# EasyEDA Pro project jlcProject.epro, schematic Schematic2
Create Date: 2025-03-26; Page Name: P1; Project Name: 电综; Schematic Name: Schematic2; Update Date: 2025-03-26; Company: 嘉立创EDA; Page Size: A4; Version: V1.0
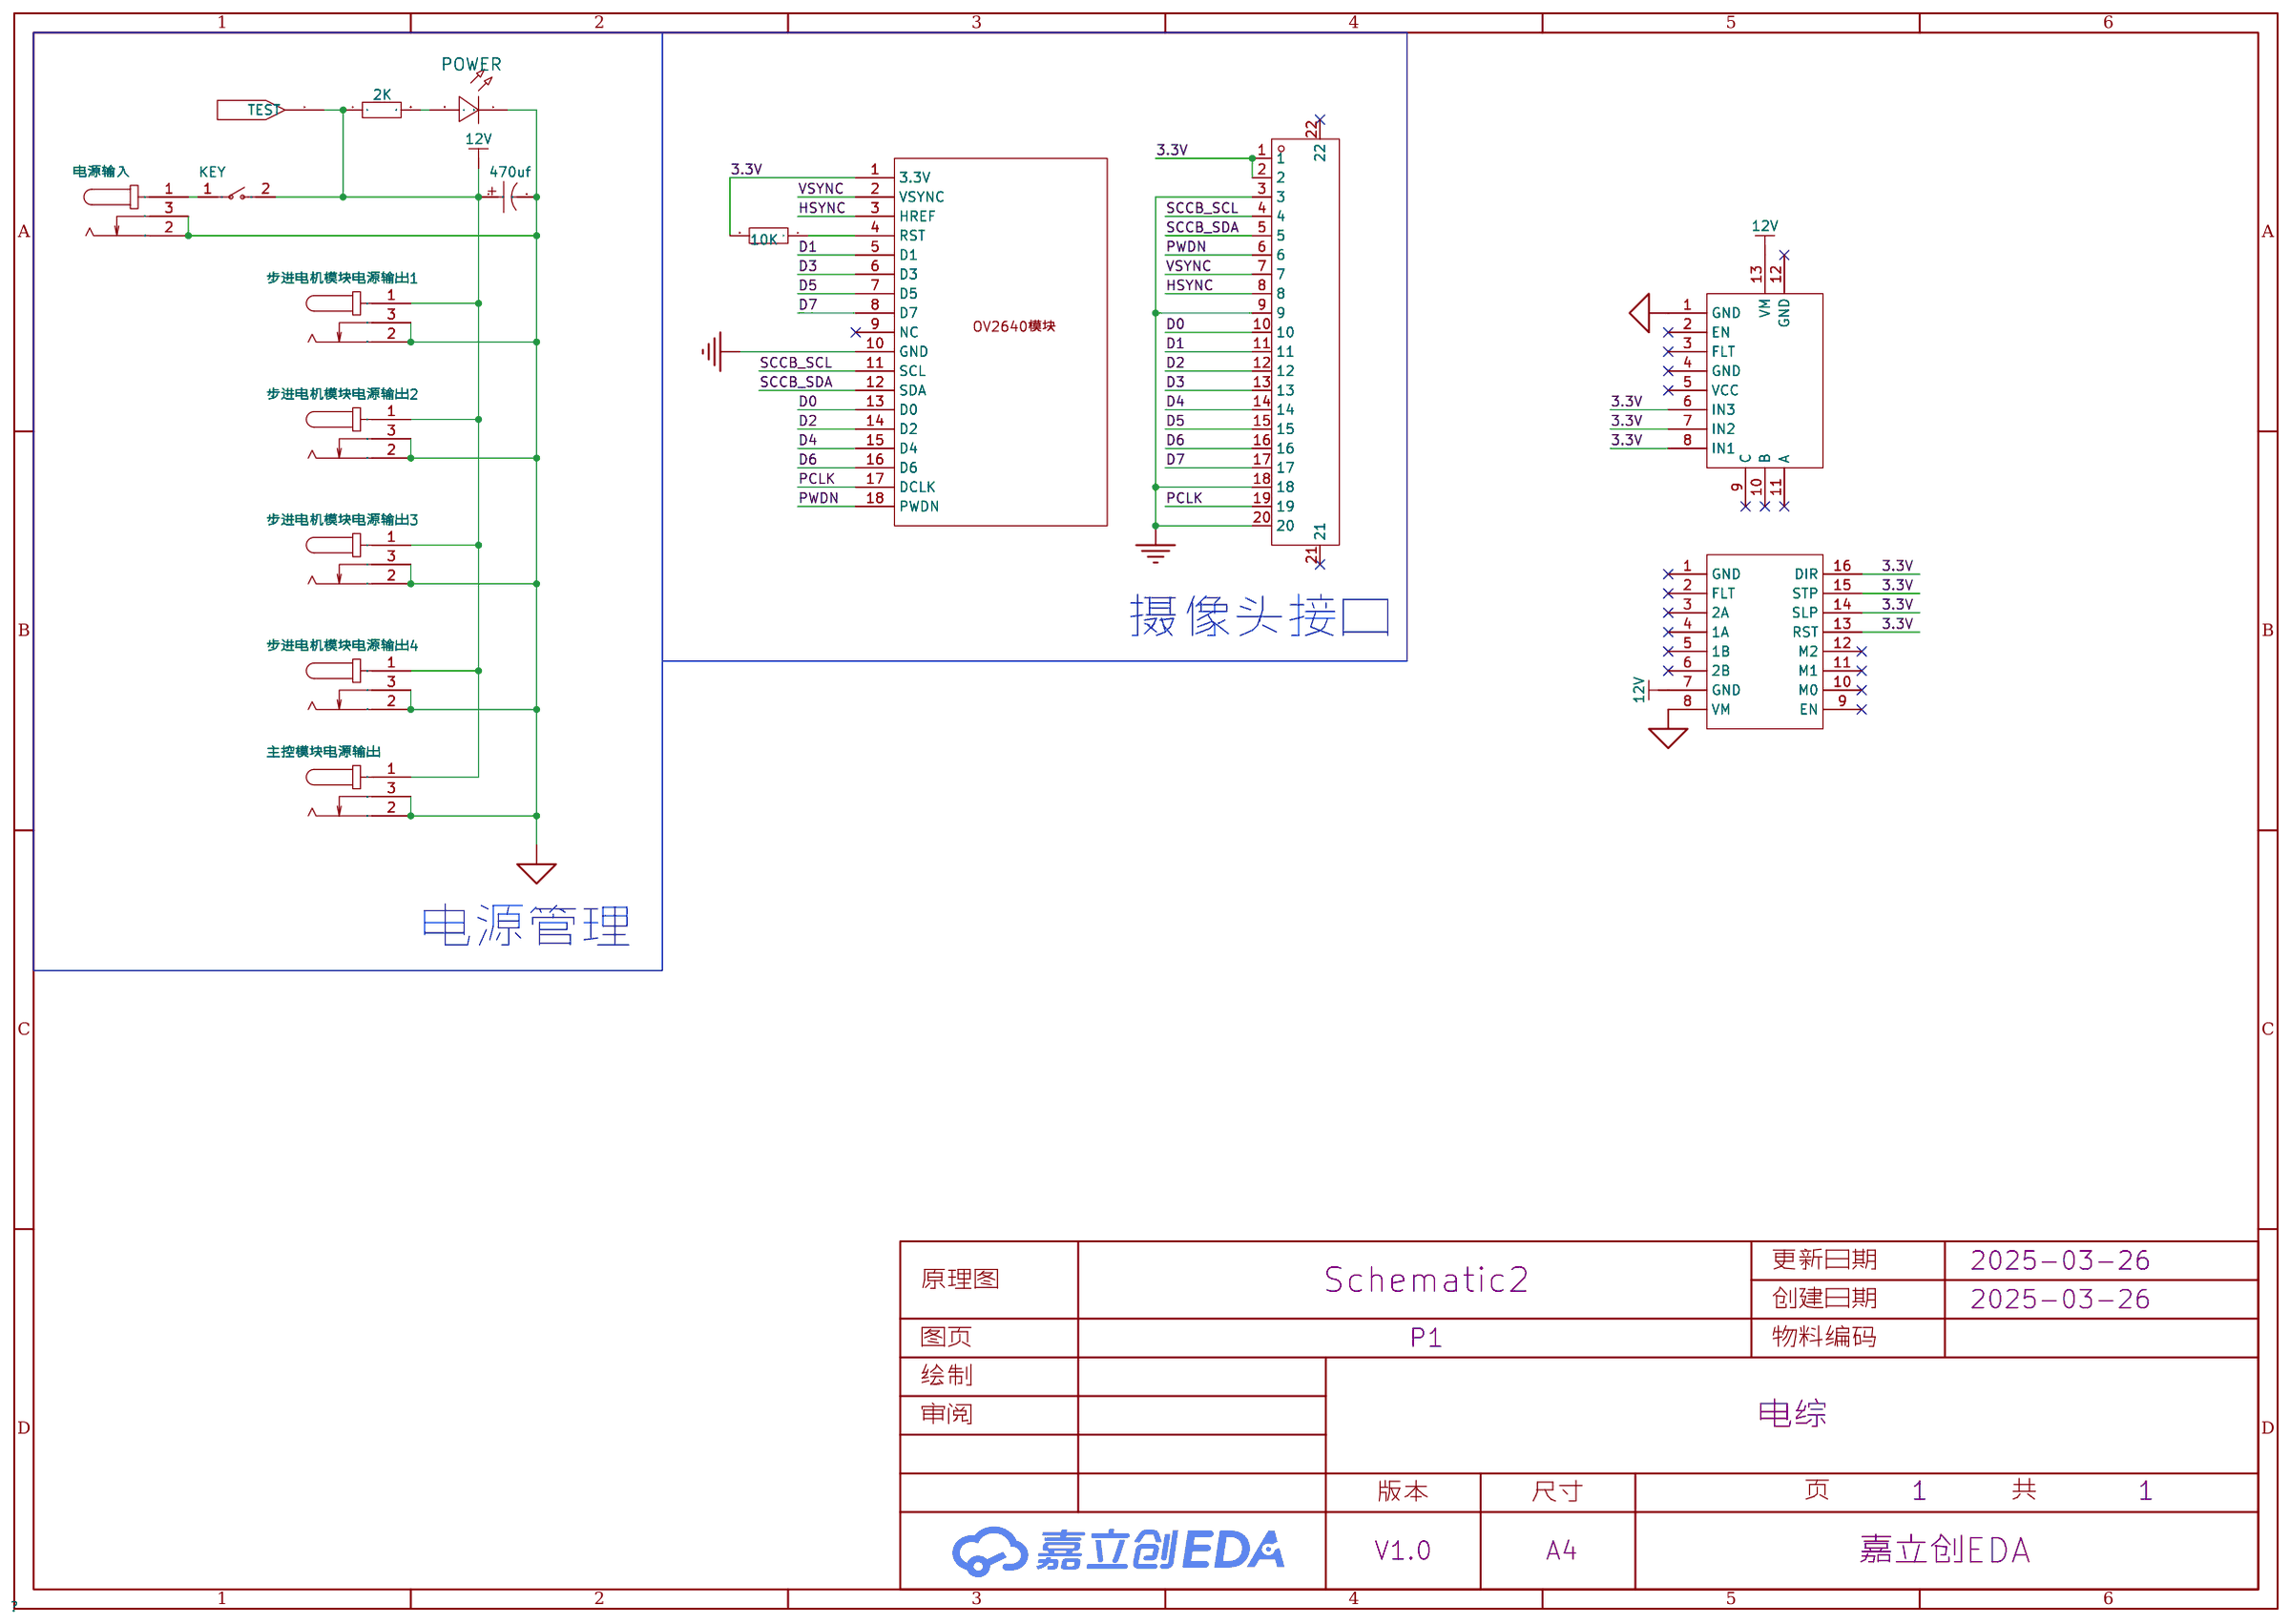
[diagram p1: schematic sheet]

## Parts
C1  470uf  [CAP-SMD_BD10.0-L10.3-W10.3-FD]
DC1  电源输入  [DC-IN-TH_DC005]
DC2  步进电机模块电源输出1  [DC-IN-TH_DC005]
DC7  步进电机模块电源输出2  [DC-IN-TH_DC005]
DC8  步进电机模块电源输出3  [DC-IN-TH_DC005]
DC9  步进电机模块电源输出4  [DC-IN-TH_DC005]
DC10  主控模块电源输出  [DC-IN-TH_DC005]
FPC1  FPC-05F-20PH20  [FPC-SMD_20P-P0.50_XUNPU_FPC-05F-20PH20]
POWER  -  [LED_0805]
R1  2K  [R0805]
R2  10K  [R0805]
SW1  KEY  [SW-TH_2P-L15.0-W10.5-P5.00_KCD11-2P-R]
U1  -  [测试点]
U2  -  [OV2640模块]
U3  -  [FOCMini]
U4  -  [DRV8825驱动模块]

## Library data of the parts
C1 = CK1V471M-CRG10: 容值:470uF;精度:±20%;额定电压:35V;纹波电流:-;等效串联电阻(ESR):-;; LCSC Part Name: 470uF ±20% 35V; Supplier Part: C129479; Manufacturer: ST(先科); Supplier Footprint: SMD,D10xL10.5mm; JLCPCB Part Class: Extended Part; Datasheet: https://atta.szlcsc.com/upload/public/pdf/source/20180511/C191812_AFB6060B7C8A92684C0DBB73273612B6.pdf; Supplier: LCSC; Tolerance: ±20%; Voltage Rating: 35V; Diameter: 10mm; Height - Seated (Max): 10.5mm; Lifetime: 2000hrs@105℃; Operating Temperature: -40℃~+105℃
DC1 DC2 DC7-DC10 = DC005: 连接器类型:DC电源插座;安装方式:弯插;触点内径:2mm;触点外径:6.3mm;额定电流:500mA;额定电压:30V;工作温度范围:-25℃~+70℃;; LCSC Part Name: DC电源插座 内径:2mm 外径:6.3mm; Supplier Part: C431533; Manufacturer: SHOU HAN(首韩); Supplier Footprint: 插件; JLCPCB Part Class: Extended Part; Datasheet: https://atta.szlcsc.com/upload/public/pdf/source/20190925/C431533_4751811035784AC1D38EBC85F7905E99.pdf; Supplier: LCSC; Connector Type: DC电源插座; Mounting Style: 弯插; Inside Contact Diameter: 2mm; Outside Contact Diameter: 6.3mm; Current Rating (Max): 500mA; Voltage Rating (Max): 30V; Operating Temperature Range: -25℃~+70℃
FPC1 = FPC-05F-20PH20: 锁定特性:翻盖式;触点类型:下接;触点数量:20P;间距:0.5mm;安装类型:卧贴;工作温度范围:-25℃~+85℃;; LCSC Part Name: 间距:0.5mm P数:20P 翻盖式 下接; Supplier Part: C2856803; Manufacturer: XUNPU(讯普); Supplier Footprint: SMD,P=0.5mm,卧贴; JLCPCB Part Class: Extended Part; Datasheet: https://atta.szlcsc.com/upload/public/pdf/source/20210922/C2856803_40AC94077DCDAD136B773224EC50E565.pdf; Supplier: LCSC; Locking Feature: 翻盖式; Contact Type: 下接; Number of Contacts: 20P; Pitch: 0.5mm; Mounting Type: 卧贴; FFC, FCB Thickness: 0.3mm; Height Above Board: 2mm; Operating Temperature Range: -25℃~+85℃
POWER = LED_0805-R: Supplier Footprint: 0805
R1 R2 = Res_0805: Supplier Footprint: 0805
SW1 = KCD11-2P-R: 带灯:无;引脚样式:焊片;额定电流:3A;额定电压(AC):250V;额定电压(DC):-;电路结构:单刀单掷;机械寿命:1万次;; LCSC Part Name: 10.5*15mm 两脚两档跷板开关 红钮; Supplier Part: C5884414; Manufacturer: SHOU HAN(首韩); Supplier Footprint: 插件; JLCPCB Part Class: Extended Part; Datasheet: https://atta.szlcsc.com/upload/public/pdf/source/20230506/CD06DFDE35C8048D34175BFF4AF6A2C2.pdf; Supplier: LCSC; Switch Length: 15mm; Switch Width: 10.5mm; Switch Height: 17.2mm; Actuator Type: 凹面弯曲; With Lamp: 无; Pin Style: 焊片; Actuator Color: 红色; Contact Current: 3A; Voltage Rating (AC): 250V; Circuit: 单刀单掷; Mechanical Life: 1万次; Operating Temperature: 0℃~+125℃; Actuator Identifier: - O
U1 = 测试点
U2 = OV2640模块
U3 = FOCMini
U4 = DRV8825模块

## Nets
3.3V: FPC1.1 FPC1.2 R2.2 U2.1(3.3V) U3.6(IN3) U3.7(IN2) U3.8(IN1) U4.13(RST) U4.14(SLP) U4.15(STP) U4.16(DIR)
12V: C1.1 DC2.1 DC7.1 DC8.1 DC9.1 DC10.1 R1.1 SW1.2 U1.1(TEST) U3.13(VM) U4.7(GND)
AGND: C1.2 DC1.2 DC1.3 DC2.2 DC2.3 DC7.2 DC7.3 DC8.2 DC8.3 DC9.2 DC9.3 DC10.2 DC10.3 POWER.1(C) U3.1(GND) U4.8(VM)
GND: FPC1.3 FPC1.9 FPC1.18 FPC1.20 U2.10(GND)
D0: FPC1.10 U2.13(D0)
D1: FPC1.11 U2.5(D1)
D2: FPC1.12 U2.14(D2)
D3: FPC1.13 U2.6(D3)
D4: FPC1.14 U2.15(D4)
D5: FPC1.15 U2.7(D5)
D6: FPC1.16 U2.16(D6)
D7: FPC1.17 U2.8(D7)
HSYNC: FPC1.8 U2.3(HREF)
PCLK: FPC1.19 U2.17(DCLK)
PWDN: FPC1.6 U2.18(PWDN)
SCCB_SCL: FPC1.4 U2.11(SCL)
SCCB_SDA: FPC1.5 U2.12(SDA)
VSYNC: FPC1.7 U2.2(VSYNC)
$1N1176: DC1.1 SW1.1
$1N1455: POWER.2(A) R1.2
$1N2369: R2.1 U2.4(RST)

Not connected (* = marked no-connect by the designer): FPC1 21* 22*; U2 9(NC)*; U3 2(EN)* 3(FLT)* 4(GND)* 5(VCC)* 9(C)* 10(B)* 11(A)* 12(GND)*; U4 1(GND)* 2(FLT)* 3(2A)* 4(1A)* 5(1B)* 6(2B)* 9(EN)* 10(M0)* 11(M1)* 12(M2)*

## Notes on the sheet
- 摄像头接口
- 电源管理
